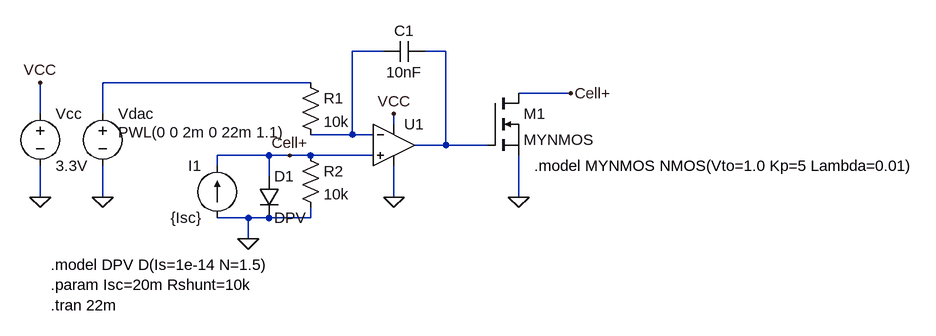
[diagram p0: schematic perovskite_sim.asc]
perovskite_sim.asc, the LTspice schematic file:
Version 4.1
SHEET 1 1112 680
WIRE 256 112 208 112
WIRE 352 112 320 112
WIRE 144 160 -176 160
WIRE 544 176 464 176
WIRE -272 208 -272 160
WIRE -176 208 -176 160
WIRE 272 224 272 208
WIRE 208 240 208 112
WIRE 208 240 144 240
WIRE 240 240 208 240
WIRE 352 256 352 112
WIRE 352 256 304 256
WIRE 416 256 352 256
WIRE 80 272 0 272
WIRE 112 272 80 272
WIRE 144 272 112 272
WIRE 240 272 144 272
WIRE 0 288 0 272
WIRE 80 304 80 272
WIRE -272 336 -272 288
WIRE -176 336 -176 288
WIRE 272 336 272 288
WIRE 464 336 464 272
WIRE 48 368 0 368
WIRE 80 368 48 368
WIRE 144 368 144 352
WIRE 144 368 80 368
WIRE 48 400 48 368
FLAG 272 336 0
FLAG 464 336 0
FLAG -176 336 0
FLAG 272 208 VCC
FLAG -272 336 0
FLAG -272 160 VCC
FLAG 112 272 Cell+
FLAG 544 176 Cell+
FLAG 48 400 0
SYMBOL voltage -176 192 R0
WINDOW 3 24 44 Left 2
WINDOW 123 0 0 Left 0
WINDOW 39 0 0 Left 0
SYMATTR InstName Vdac
SYMATTR Value PWL(0 0 2m 0 22m 1.1)
SYMBOL res 128 144 R0
SYMATTR InstName R1
SYMATTR Value 10k
SYMBOL cap 320 96 R90
WINDOW 0 0 32 VBottom 2
WINDOW 3 32 32 VTop 2
SYMATTR InstName C1
SYMATTR Value 10nF
SYMBOL nmos 416 176 R0
SYMATTR InstName M1
SYMATTR Value MYNMOS
SYMBOL voltage -272 192 R0
SYMATTR InstName Vcc
SYMATTR Value 3.3V
SYMBOL current 0 368 R180
WINDOW 0 24 80 Left 2
WINDOW 3 24 0 Left 2
SYMATTR InstName I1
SYMATTR Value {Isc}
SYMBOL diode 64 304 R0
SYMATTR InstName D1
SYMATTR Value DPV
SYMBOL res 128 256 R0
SYMATTR InstName R2
SYMATTR Value 10k
SYMBOL OpAmps\\UniversalOpAmp2 272 256 R0
SYMATTR InstName U1
TEXT -256 440 Left 2 !.model DPV D(Is=1e-14 N=1.5)\n.param Isc=20m Rshunt=10k\n.tran 22m
TEXT 488 288 Left 2 !.model MYNMOS NMOS(Vto=1.0 Kp=5 Lambda=0.01)

The netlist it stands for:
* perovskite_sim.asc
Vdac N003 0 PWL(0 0 2m 0 22m 1.1)
R1 N003 N001 10k
C1 N002 N001 10nF
M1 Cell+ N002 0 0 MYNMOS
Vcc VCC 0 3.3V
I1 0 Cell+ {Isc}
D1 Cell+ 0 DPV
R2 Cell+ 0 10k
X§U1 Cell+ N001 VCC 0 N002 level2 Avol=1Meg GBW=10Meg Slew=10Meg Ilimit=25m Rail=0 Vos=0 En=0 Enk=0 In=0 Ink=0 Rin=500Meg  ; pins In+ In- V+ V- OUT
.model D D
.lib standard.dio
.model NMOS NMOS
.model PMOS PMOS
.lib standard.mos
.model DPV D(Is=1e-14 N=1.5)
.param Isc=20m Rshunt=10k
.tran 22m
.model MYNMOS NMOS(Vto=1.0 Kp=5 Lambda=0.01)
.lib UniversalOpAmp2.lib
.backanno
.end